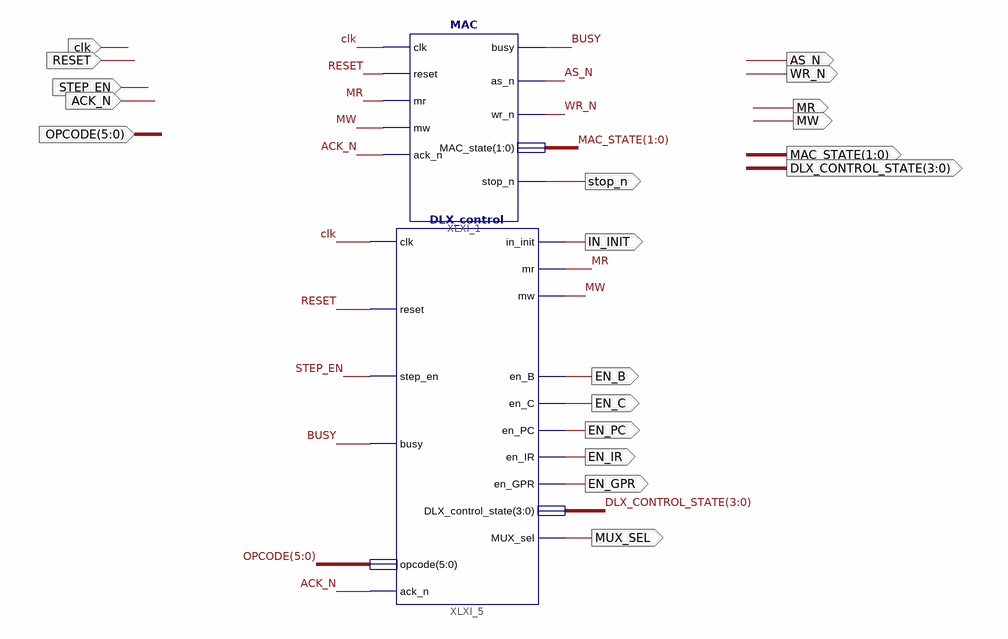
[diagram p0: schematic sheet 1]
// Xilinx ISE schematic control.sch (artix7) as structural Verilog: 2 symbols, 19 ports
module control (
  input  clk,
  input  RESET,
  input  ACK_N,
  input  STEP_EN,
  input  [5:0] OPCODE,
  output AS_N,
  output MW,
  output WR_N,
  output IN_INIT,
  output MR,
  output EN_B,
  output EN_C,
  output EN_PC,
  output EN_IR,
  output EN_GPR,
  output MUX_SEL,
  output [1:0] MAC_STATE,
  output [3:0] DLX_CONTROL_STATE,
  output stop_n
);

  wire BUSY;

  DLX_control XLXI_5 (
    .clk(clk), .reset(RESET), .step_en(STEP_EN), .busy(BUSY), .opcode(OPCODE), .in_init(IN_INIT), .mr(MR),
    .mw(MW), .en_B(EN_B), .en_C(EN_C), .en_PC(EN_PC), .en_IR(EN_IR), .en_GPR(EN_GPR), .MUX_sel(MUX_SEL),
    .DLX_control_state(DLX_CONTROL_STATE), .ack_n(ACK_N));
  MAC XLXI_1 (
    .ack_n(ACK_N), .clk(clk), .mr(MR), .mw(MW), .reset(RESET), .as_n(AS_N), .busy(BUSY), .wr_n(WR_N),
    .stop_n(stop_n), .MAC_state(MAC_STATE));
endmodule
